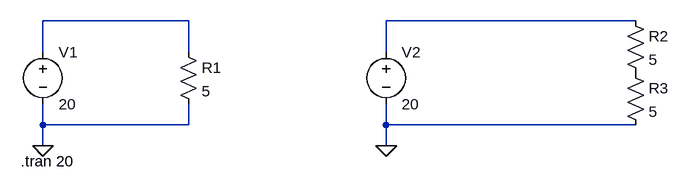
[diagram p0: schematic LAB_001_Tonino_Kent_Louise.asc]
LAB_001_Tonino_Kent_Louise.asc, the LTspice schematic file:
Version 4
SHEET 1 880 680
WIRE 128 -16 -96 -16
WIRE 816 -16 432 -16
WIRE -96 32 -96 -16
WIRE 128 32 128 -16
WIRE 432 32 432 -16
WIRE -96 144 -96 112
WIRE 128 144 128 112
WIRE 128 144 -96 144
WIRE 432 144 432 112
WIRE 816 144 432 144
WIRE -96 176 -96 144
WIRE 432 176 432 144
FLAG 432 176 0
FLAG -96 176 0
SYMBOL res 112 16 R0
SYMATTR InstName R1
SYMATTR Value 5
SYMBOL voltage -96 16 R0
WINDOW 123 0 0 Left 0
WINDOW 39 0 0 Left 0
SYMATTR InstName V1
SYMATTR Value 20
SYMBOL voltage 432 16 R0
WINDOW 123 0 0 Left 0
WINDOW 39 0 0 Left 0
SYMATTR InstName V2
SYMATTR Value 20
SYMBOL res 800 -32 R0
SYMATTR InstName R2
SYMATTR Value 5
SYMBOL res 800 48 R0
SYMATTR InstName R3
SYMATTR Value 5
TEXT -130 200 Left 2 !.tran 20

The netlist it stands for:
* LAB_001_Tonino_Kent_Louise.asc
R1 N001 0 5
V1 N001 0 20
V2 N002 0 20
R2 N002 P001 5
R3 P001 0 5
.tran 20
.backanno
.end